# Altium schematic sheet fanap.SchDoc
size A; SheetNumber: 1; SheetTotal: 1
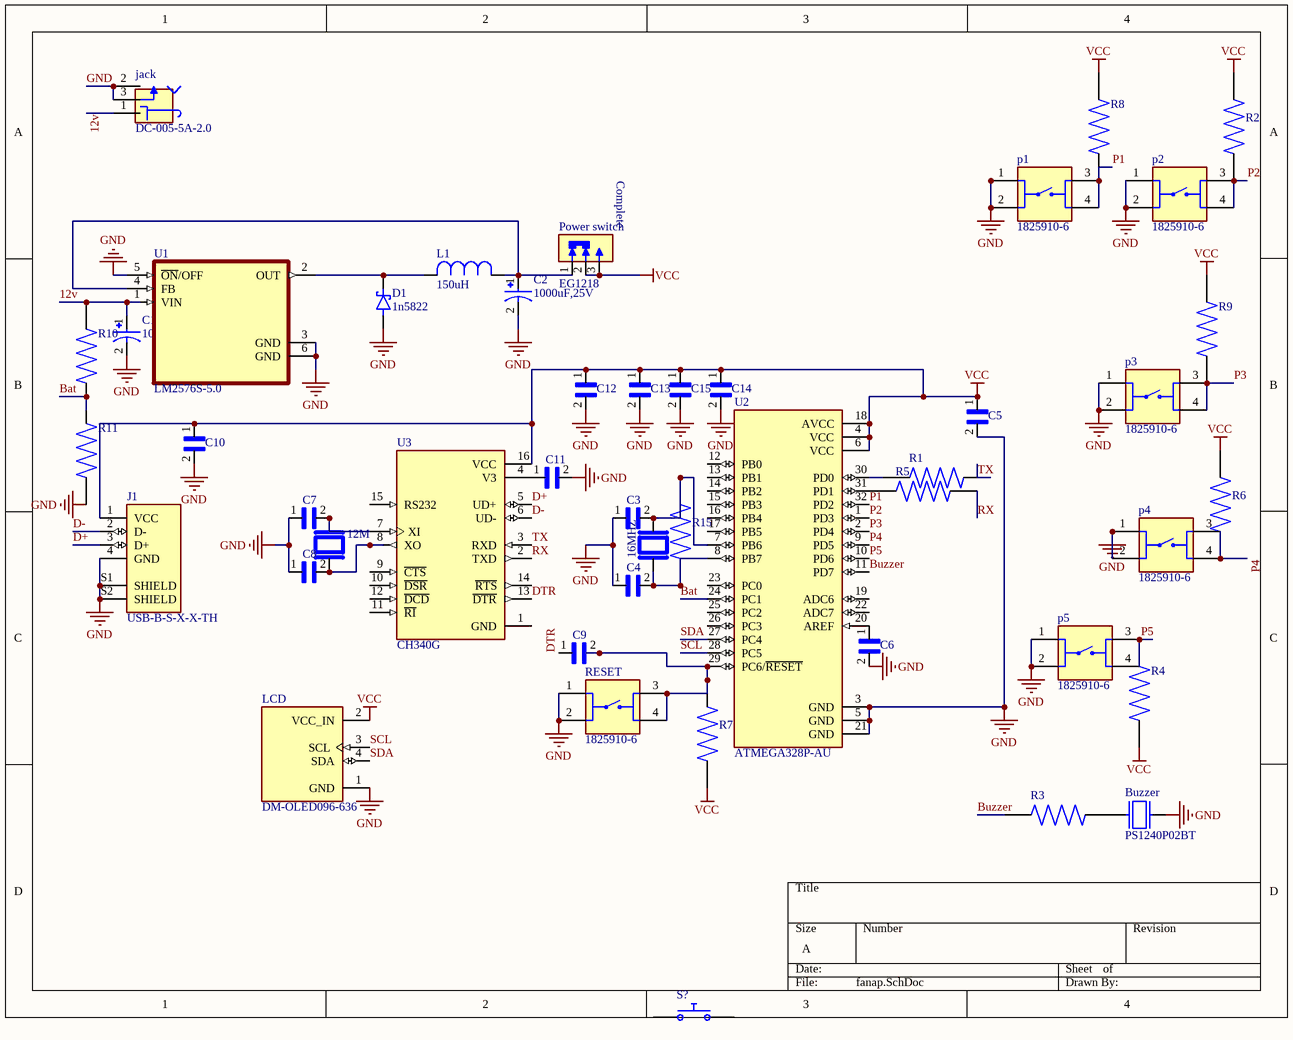
[diagram p0: fanap.SchDoc]

## Parts
12M  (no value)  [XTAL_HC49P488W46L1150T500H350]
16MHZ  (no value)  [XTAL_HC49P488W46L1150T500H350]
Buzzer  PS1240P02BT  [XDCR_PS1240P02BT]
C1  100uF,75V  [CAP_20TDC100MYF]
C2  1000uF,25V  [CAP_20TDC100MYF]
C3  (no value)  [CAPC3216X180N]
C4  (no value)  [CAPC3216X180N]
C5  (no value)  [CAPC3216X180N]
C6  (no value)  [CAPC3216X180N]
C7  (no value)  [CAPC3216X180N]
C8  (no value)  [CAPC3216X180N]
C9  (no value)  [CAPC3216X180N]
C10  (no value)  [CAPC3216X180N]
C11  (no value)  [CAPC3216X180N]
C12  (no value)  [CAPC3216X180N]
C13  (no value)  [CAPC3216X180N]
C14  (no value)  [CAPC3216X180N]
C15  (no value)  [CAPC3216X180N]
D1  1n5822  [DIOM7959X265N]
J1  USB-B-S-X-X-TH  [SAMTEC_USB-B-S-X-X-TH]
jack  DC-005-5A-2.0  [XKB_DC-005-5A-2.0]
L1  150uH  [IND_CDRH127/LDNP-470MC_SUM]
LCD  DM-OLED096-636  [MODULE_DM-OLED096-636]
p1  1825910-6  [SW_1825910-6-4]
p2  1825910-6  [SW_1825910-6-4]
p3  1825910-6  [SW_1825910-6-4]
p4  1825910-6  [SW_1825910-6-4]
p5  1825910-6  [SW_1825910-6-4]
Power_switch  EG1218  [SW_EG1218]
R1  PFC-W1206LF-12-1002-B  [RESC3216X70N]  (value not drawn)
R2  PFC-W1206LF-12-1002-B  [RESC3216X70N]  (value not drawn)
R3  PFC-W1206LF-12-1002-B  [RESC3216X70N]  (value not drawn)
R4  PFC-W1206LF-12-1002-B  [RESC3216X70N]  (value not drawn)
R5  PFC-W1206LF-12-1002-B  [RESC3216X70N]  (value not drawn)
R6  PFC-W1206LF-12-1002-B  [RESC3216X70N]  (value not drawn)
R7  PFC-W1206LF-12-1002-B  [RESC3216X70N]  (value not drawn)
R8  PFC-W1206LF-12-1002-B  [RESC3216X70N]  (value not drawn)
R9  PFC-W1206LF-12-1002-B  [RESC3216X70N]  (value not drawn)
R10  PFC-W1206LF-12-1002-B  [RESC3216X70N]  (value not drawn)
R11  PFC-W1206LF-12-1002-B  [RESC3216X70N]  (value not drawn)
R15  PFC-W1206LF-12-1002-B  [RESC3216X70N]  (value not drawn)
RESET  1825910-6  [SW_1825910-6-4]
S?  Push Button Normally Opened  (value not drawn)
U1  LM2576S-5.0  [VREG_TPS79625KTTR]
U2  ATMEGA328P-AU  [QFP80P900X900X120-32N]
U3  CH340G  [SOIC127P600X180-16N]

## Nets
GND: Buzzer.2 C1.2 C2.2 C3.1 C4.1 C5.2 C6.2 C7.1 C8.1 C10.2 C11.2 C12.2 C13.2 C14.2 C15.2 D1.A J1.4(GND) J1.S1(SHIELD) J1.S2(SHIELD) jack.2 jack.3 LCD.1(GND) p1.1 p1.2 p2.1 p2.2 p3.1 p3.2 p4.1 p4.2 p5.1 p5.2 R11.1 RESET.1 RESET.2 U1.3(GND) U1.5(~{ON}/OFF) U1.6(GND) U2.3(GND) U2.5(GND) U2.21(GND)
VCC: C5.1 C10.1 C12.1 C13.1 C14.1 C15.1 J1.1(VCC) LCD.2(VCC_IN) Power_switch.2(COM) Power_switch.3(NO) R2.1 R4.2 R6.1 R7.2 R8.2 R9.2 U2.4(VCC) U2.6(VCC) U2.18(AVCC) U3.16(VCC)
12v: C1.1 jack.1 R10.2 U1.1(VIN)
Bat: R10.1 R11.2 U2.24(PC1)
Buzzer: R3.1 U2.11(PD7)
D+: J1.3(D+) U3.5(UD+)
D-: J1.2(D-) U3.6(UD-)
DTR: C9.1 U3.13(~{DTR})
P1: p1.3 p1.4 R8.1 U2.32(PD2)
P2: p2.3 p2.4 R2.2 U2.1(PD3)
P3: p3.3 p3.4 R9.1 U2.2(PD4)
P4: p4.3 p4.4 R6.2 U2.9(PD5)
P5: p5.3 p5.4 R4.1 U2.10(PD6)
RX: R5.2 U3.2(TXD)
SCL: LCD.3(SCL) U2.28(PC5)
SDA: LCD.4(SDA) U2.27(PC4)
TX: R1.2 U3.3(RXD)
Net12M_1: 12M.1 C7.2 U3.7(XI)
Net12M_2: 12M.2 C8.2 U3.8(XO)
Net16MHZ_1: 16MHZ.1 C4.2 R15.1 U2.8(PB7)
Net16MHZ_2: 16MHZ.2 C3.2 R15.2 U2.7(PB6)
NetBuzzer_1: Buzzer.1 R3.2
NetC2_1: C2.1 L1.1 Power_switch.1(NC) U1.4(FB)
NetC6_1: C6.1 U2.20(AREF)
NetC9_2: C9.2 R7.1 RESET.3 RESET.4 U2.29(PC6/~{RESET})
NetC11_1: C11.1 U3.4(V3)
NetD1_C: D1.C(K) L1.2 U1.2(OUT)
NetR1_1: R1.1 U2.30(PD0)
NetR5_1: R5.1 U2.31(PD1)

Not connected (* = marked no-connect by the designer): S? 1 2; U2 12(PB0) 13(PB1) 14(PB2) 15(PB3) 16(PB4) 17(PB5) 19(ADC6) 22(ADC7) 23(PC0) 25(PC2) 26(PC3); U3 1(GND) 9(~{CTS}) 10(~{DSR}) 11(~{RI}) 12(~{DCD}) 14(~{RTS}) 15(RS232)

## Notes on the sheet
- (near Power_switch) Complete

## Library data of the parts
12M 16MHZ = ABL-16.000MHZ-B2-T: HC/49US (AT49) MICROPROCESSOR CRYSTAL; MF: Abracon; Price: None; SnapEDA_Link: https://www.snapeda.com/parts/ABL-16.000MHZ-B2/Abracon+LLC/view-part/?ref=snap; MP: ABL-16.000MHZ-B2; Purchase-URL: https://pricing.snapeda.com/search/part/ABL-16.000MHZ-B2/?ref=eda; Value: *; Availability: In Stock; Package: HC-49/US ABRACON; Check_prices: https://www.snapeda.com/parts/ABL-16.000MHZ-B2/Abracon+LLC/view-part/?ref=eda
Buzzer = PS1240P02BT: Buzzers Transducer, Externally Driven Piezo 3V 4kHz 60dB @ 3V, 10cm Through Hole PC Pins; MF: TDK; MP: PS1240P02BT; Availability: Unavailable; Package: 2020 TDK; Value: *; Price: None; SnapEDA_Link: https://www.snapeda.com/parts/PS1240P02BT/TDK/view-part/53420/?ref=snap
C1 = 20TDC100MYF: Cap Tant Polymer 100uF 20VDC D3L CASE 20% (7.3 X 4.3 X 2.8mm) SMD 0.055 Ohm 125Â°C T/R; MF: Panasonic Electronic Components; Check_prices: https://www.snapeda.com/parts/20TDC100MYF/Panasonic/view-part/?ref=eda; Package: 7343-2 Panasonic; MP: 20TDC100MYF; Value: *; SnapEDA_Link: https://www.snapeda.com/parts/20TDC100MYF/Panasonic/view-part/?ref=snap; Availability: In Stock; Price: None; Purchase-URL: https://pricing.snapeda.com/search/part/20TDC100MYF/?ref=eda
C2 = 20TDC100MYF: MF: Panasonic Electronic Components; Check_prices: https://www.snapeda.com/parts/20TDC100MYF/Panasonic/view-part/?ref=eda; Package: 7343-2 Panasonic; MP: 20TDC100MYF; Value: *; SnapEDA_Link: https://www.snapeda.com/parts/20TDC100MYF/Panasonic/view-part/?ref=snap; Availability: In Stock; Price: None; Purchase-URL: https://pricing.snapeda.com/search/part/20TDC100MYF/?ref=eda
C3-C15 = GRM31C5C1H104JA01K: SMD Capacitor C0G(EIA) with Capacitance: 0.10uF Tol. 5%. Rated Voltage: 50Vdc; MF: Murata; Value: *; Package: 3216 Murata; Digi-Key_Part_Number: 490-8335-1-ND; Check_prices: https://www.snapeda.com/parts/GRM31C5C1H104JA01K/Murata/view-part/1759130/?ref=eda; SnapEDA_Link: https://www.snapeda.com/parts/GRM31C5C1H104JA01K/Murata/view-part/1759130/?ref=snap; Purchase-URL: https://pricing.snapeda.com/search/part/GRM31C5C1H104JA01K/?ref=eda; MP: GRM31C5C1H104JA01K
D1 = SS34: Diode Schottky 40 V 3A Surface Mount SMC (DO-214AB); MF: onsemi; SnapEDA_Link: https://www.snapeda.com/parts/SS34/Onsemi/view-part/?ref=snap; Package: SMC-2 ON Semiconductor; Value: *; MP: SS34; Check_prices: https://www.snapeda.com/parts/SS34/Onsemi/view-part/?ref=eda; ComponentLink1Description: Link; ComponentLink1URL: https://ickala.com/schottky-diode/17325-1n5822-smd-sizea.html
J1 = USB-B-S-X-X-TH: USB-B (USB TYPE-B) USB 2.0 Receptacle Connector 4 Position Through Hole, Right Angle; MF: Samtec; MP: USB-B-S-F-W-TH-TR; SnapEDA_Link: https://www.snapeda.com/parts/USB-B-S-F-W-TH-TR/Samtec/view-part/?ref=snap; Package: None; Value: *; Check_prices: https://www.snapeda.com/parts/USB-B-S-F-W-TH-TR/Samtec/view-part/?ref=eda
jack = DC-005-5A-2.0: DC Power Receptacle Jack, Through Holeï¼ŒRight Angle; MF: XKB Industrial Precision; SnapEDA_Link: https://www.snapeda.com/parts/DC-005-5A-2.0/XKB+Industrial+Precision/view-part/?ref=snap; Package: Package; Value: *; MP: DC-005-5A-2.0; Check_prices: https://www.snapeda.com/parts/DC-005-5A-2.0/XKB+Industrial+Precision/view-part/?ref=eda
L1 = CDRH127/LDNP-470MC: 12*12; MF: Sumida America; SnapEDA_Link: https://www.snapeda.com/parts/CDRH127/LDNP-470MC/Sumida+America+Components+Inc./view-part/?ref=snap; MP: CDRH127/LDNP-470MC; Availability: In Stock; Price: None; Value: *; Check_prices: https://www.snapeda.com/parts/CDRH127/LDNP-470MC/Sumida+America+Components+Inc./view-part/?ref=eda; Package: Nonstandard Sumida; Purchase-URL: https://pricing.snapeda.com/search/part/CDRH127/LDNP-470MC/?ref=eda; ComponentLink1Description: link; ComponentLink1URL: https://ickala.com/power-inductor-1212/44388-rh127-150uh.html
LCD = DM-OLED096-636: 0.96â€ 128 X 64 MONOCHROME GRAPHIC OLED DISPLAY MODULE - I2C; SnapEDA_Link: https://www.snapeda.com/parts/DM-OLED096-636/Display+Module/view-part/?ref=snap; Package: Package; Value: *; MF: Display Module; MP: DM-OLED096-636; Check_prices: https://www.snapeda.com/parts/DM-OLED096-636/Display+Module/view-part/?ref=eda
p1-p5 RESET = 1825910-6: Switch Push Button OFF (ON) SPST Round Button 0.05A 24VDC Momentary Contact PC Pins Thru-Hole; MF: TE Connectivity; Value: *; MP: 1825910-6; Package: None; Check_prices: https://www.snapeda.com/parts/1825910-6/TE+Connectivity+ALCOSWITCH+Switches/view-part/?ref=eda; SnapEDA_Link: https://www.snapeda.com/parts/1825910-6/TE+Connectivity+ALCOSWITCH+Switches/view-part/?ref=snap; Digi-Key_Part_Number: 450-1650-ND; Purchase-URL: https://pricing.snapeda.com/search/part/1825910-6/?ref=eda
Power_switch = EG1218: Slide Switch, EG Series, SPDT, Non-Shorting, ON-ON, 200mA DC, 30VDC, PC Pin | E-Switch EG1218; SnapEDA_Link: https://www.snapeda.com/parts/EG1218/E-Switch/view-part/?ref=snap; Package: None; Value: *; MF: E-Switch; MP: EG1218; Check_prices: https://www.snapeda.com/parts/EG1218/E-Switch/view-part/?ref=eda
R1-R11 R15 = PFC-W1206LF-12-1002-B: Thin Film Resistors - SMD 10K OHM .1% 10PPM; MF: International Resistive; Value: *; SnapEDA_Link: https://www.snapeda.com/parts/PFC-W1206LF-12-1002-B/International%20Resistive/view-part/1192591/?ref=snap; Price: None; Availability: Unavailable; Package: 1206 International Resistive; MP: PFC-W1206LF-12-1002-B
S? = Push Button NO: closed: 0; Rclosed: 1m; Ropen: 1Meg; SimulationGenericComponent: True
U1 = LM2576S-5.0: SIMPLE SWITCHER&reg; 40V, 3A Low Component Count Step-Down Regulator 5-DDPAK/TO-263 -40 to 125; MF: Texas Instruments; Value: *; SnapEDA_Link: https://www.snapeda.com/parts/LM2576S-5.0/Texas+Instruments/view-part/?ref=snap; Purchase-URL: https://pricing.snapeda.com/search/part/LM2576S-5.0/?ref=eda; Availability: In Stock; Price: None; Package: TO-263-5 Texas Instruments; Check_prices: https://www.snapeda.com/parts/LM2576S-5.0/Texas+Instruments/view-part/?ref=eda; MP: LM2576S-5.0; ComponentLink1Description: link; ComponentLink1URL: https://roboeq.ir/products/detail/0306088/%D8%B1%DA%AF%D9%88%D9%84%D8%A7%D8%AA%D9%88%D8%B1-5-%D9%88%D9%84%D8%AA-LM2576S-SMD/
U2 = ATMEGA328P-AU: AVR AVRÂ® ATmega Microcontroller IC 8-Bit 20MHz 32KB (16K x 16) FLASH 32-TQFP (7x7); MF: Microchip; SnapEDA_Link: https://www.snapeda.com/parts/ATMEGA328P-AU/Microchip/view-part/?ref=snap; Package: TQFP-32 Microchip; Value: *; MP: ATMEGA328P-AU; Check_prices: https://www.snapeda.com/parts/ATMEGA328P-AU/Microchip/view-part/?ref=eda
U3 = CH340G: USB Interface Integrated Circuit; MF: WCH; Value: *; SnapEDA_Link: https://www.snapeda.com/parts/Ch340G/WCH/view-part/?ref=snap; MP: Ch340G; Check_prices: https://www.snapeda.com/parts/Ch340G/WCH/view-part/?ref=eda; Availability: Not in stock; Price: None; Package: None